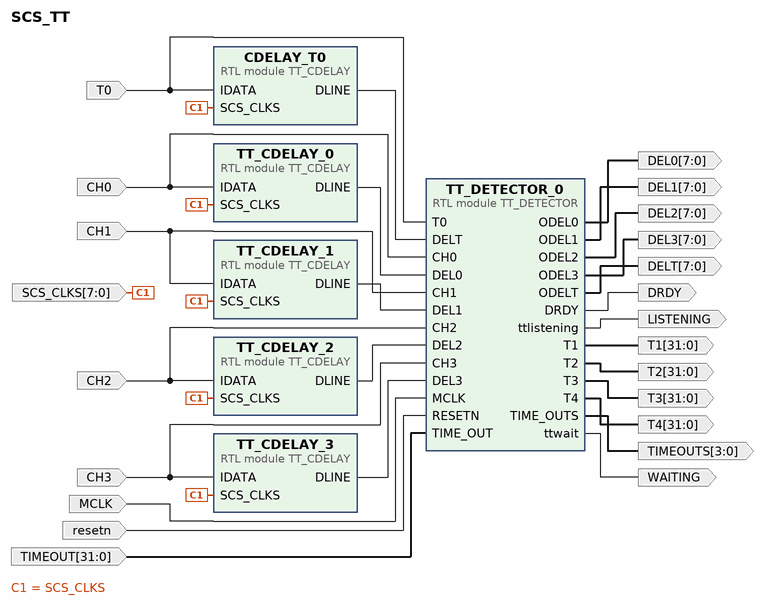
[diagram p0: block diagram of the top level]
# Vivado block design SCS_TT, xc7z020clg400-1, Vivado 2019.1
create_bd_design SCS_TT

create_bd_port -dir I T0
create_bd_port -dir I CH0
create_bd_port -dir I CH1
create_bd_port -dir I CH2
create_bd_port -dir I CH3
create_bd_port -dir I -type clk MCLK
set_property -dict {CONFIG.FREQ_HZ 460000000} [get_bd_ports MCLK]
create_bd_port -dir I -type rst resetn
create_bd_port -dir I -from 31 -to 0 -type data TIMEOUT
create_bd_port -dir O -from 31 -to 0 -type data T1
create_bd_port -dir O -from 31 -to 0 -type data T2
create_bd_port -dir O -from 31 -to 0 -type data T3
create_bd_port -dir O -from 31 -to 0 -type data T4
create_bd_port -dir O -from 3 -to 0 -type data TIMEOUTS
create_bd_port -dir O -type data DRDY
create_bd_port -dir O -type data WAITING
create_bd_port -dir O -type data LISTENING
create_bd_port -dir O -from 7 -to 0 -type data DELT
create_bd_port -dir O -from 7 -to 0 -type data DEL0
create_bd_port -dir O -from 7 -to 0 -type data DEL1
create_bd_port -dir O -from 7 -to 0 -type data DEL2
create_bd_port -dir O -from 7 -to 0 -type data DEL3
create_bd_port -dir I -from 7 -to 0 -type clk SCS_CLKS
set_property -dict {CONFIG.FREQ_HZ 460000000} [get_bd_ports SCS_CLKS]

create_bd_cell -type module -reference TT_CDELAY TT_CDELAY_0
create_bd_cell -type module -reference TT_CDELAY TT_CDELAY_1
create_bd_cell -type module -reference TT_CDELAY TT_CDELAY_2
create_bd_cell -type module -reference TT_CDELAY TT_CDELAY_3
create_bd_cell -type module -reference TT_CDELAY CDELAY_T0
create_bd_cell -type module -reference TT_DETECTOR TT_DETECTOR_0

# ---- connections ----

connect_bd_net -net T0_1 [get_bd_ports T0] [get_bd_pins CDELAY_T0/IDATA] [get_bd_pins TT_DETECTOR_0/T0]
connect_bd_net -net CH0_1 [get_bd_ports CH0] [get_bd_pins TT_CDELAY_0/IDATA] [get_bd_pins TT_DETECTOR_0/CH0]
connect_bd_net -net CH1_1 [get_bd_ports CH1] [get_bd_pins TT_CDELAY_1/IDATA] [get_bd_pins TT_DETECTOR_0/CH1]
connect_bd_net -net CH2_1 [get_bd_ports CH2] [get_bd_pins TT_CDELAY_2/IDATA] [get_bd_pins TT_DETECTOR_0/CH2]
connect_bd_net -net CH3_1 [get_bd_ports CH3] [get_bd_pins TT_CDELAY_3/IDATA] [get_bd_pins TT_DETECTOR_0/CH3]
connect_bd_net [get_bd_ports SCS_CLKS] \
  [get_bd_pins TT_CDELAY_0/SCS_CLKS] [get_bd_pins TT_CDELAY_1/SCS_CLKS] [get_bd_pins TT_CDELAY_2/SCS_CLKS] \
  [get_bd_pins TT_CDELAY_3/SCS_CLKS] [get_bd_pins CDELAY_T0/SCS_CLKS]
connect_bd_net [get_bd_pins TT_CDELAY_0/DLINE] [get_bd_pins TT_DETECTOR_0/DEL0]
connect_bd_net [get_bd_pins CDELAY_T0/DLINE] [get_bd_pins TT_DETECTOR_0/DELT]
connect_bd_net [get_bd_pins TT_CDELAY_1/DLINE] [get_bd_pins TT_DETECTOR_0/DEL1]
connect_bd_net [get_bd_pins TT_CDELAY_2/DLINE] [get_bd_pins TT_DETECTOR_0/DEL2]
connect_bd_net [get_bd_pins TT_CDELAY_3/DLINE] [get_bd_pins TT_DETECTOR_0/DEL3]
connect_bd_net [get_bd_ports MCLK] [get_bd_pins TT_DETECTOR_0/MCLK]
connect_bd_net [get_bd_ports resetn] [get_bd_pins TT_DETECTOR_0/RESETN]
connect_bd_net [get_bd_ports TIMEOUT] [get_bd_pins TT_DETECTOR_0/TIME_OUT]
connect_bd_net [get_bd_pins TT_DETECTOR_0/T1] [get_bd_ports T1]
connect_bd_net [get_bd_pins TT_DETECTOR_0/T2] [get_bd_ports T2]
connect_bd_net [get_bd_pins TT_DETECTOR_0/T3] [get_bd_ports T3]
connect_bd_net [get_bd_pins TT_DETECTOR_0/T4] [get_bd_ports T4]
connect_bd_net [get_bd_pins TT_DETECTOR_0/TIME_OUTS] [get_bd_ports TIMEOUTS]
connect_bd_net [get_bd_pins TT_DETECTOR_0/DRDY] [get_bd_ports DRDY]
connect_bd_net [get_bd_pins TT_DETECTOR_0/ttwait] [get_bd_ports WAITING]
connect_bd_net [get_bd_pins TT_DETECTOR_0/ttlistening] [get_bd_ports LISTENING]
connect_bd_net [get_bd_pins TT_DETECTOR_0/ODELT] [get_bd_ports DELT]
connect_bd_net [get_bd_pins TT_DETECTOR_0/ODEL0] [get_bd_ports DEL0]
connect_bd_net [get_bd_pins TT_DETECTOR_0/ODEL1] [get_bd_ports DEL1]
connect_bd_net [get_bd_pins TT_DETECTOR_0/ODEL2] [get_bd_ports DEL2]
connect_bd_net [get_bd_pins TT_DETECTOR_0/ODEL3] [get_bd_ports DEL3]

validate_bd_design
save_bd_design
